# Altium project MB1165.PrjPCB (part 3 of 4)

## Sheet MCU.SchDoc: MCU
size A3; DocumentNumber: MB1165; Revision: C.1; SheetNumber: 2; SheetTotal: 17; Project: STM32469I-EVAL
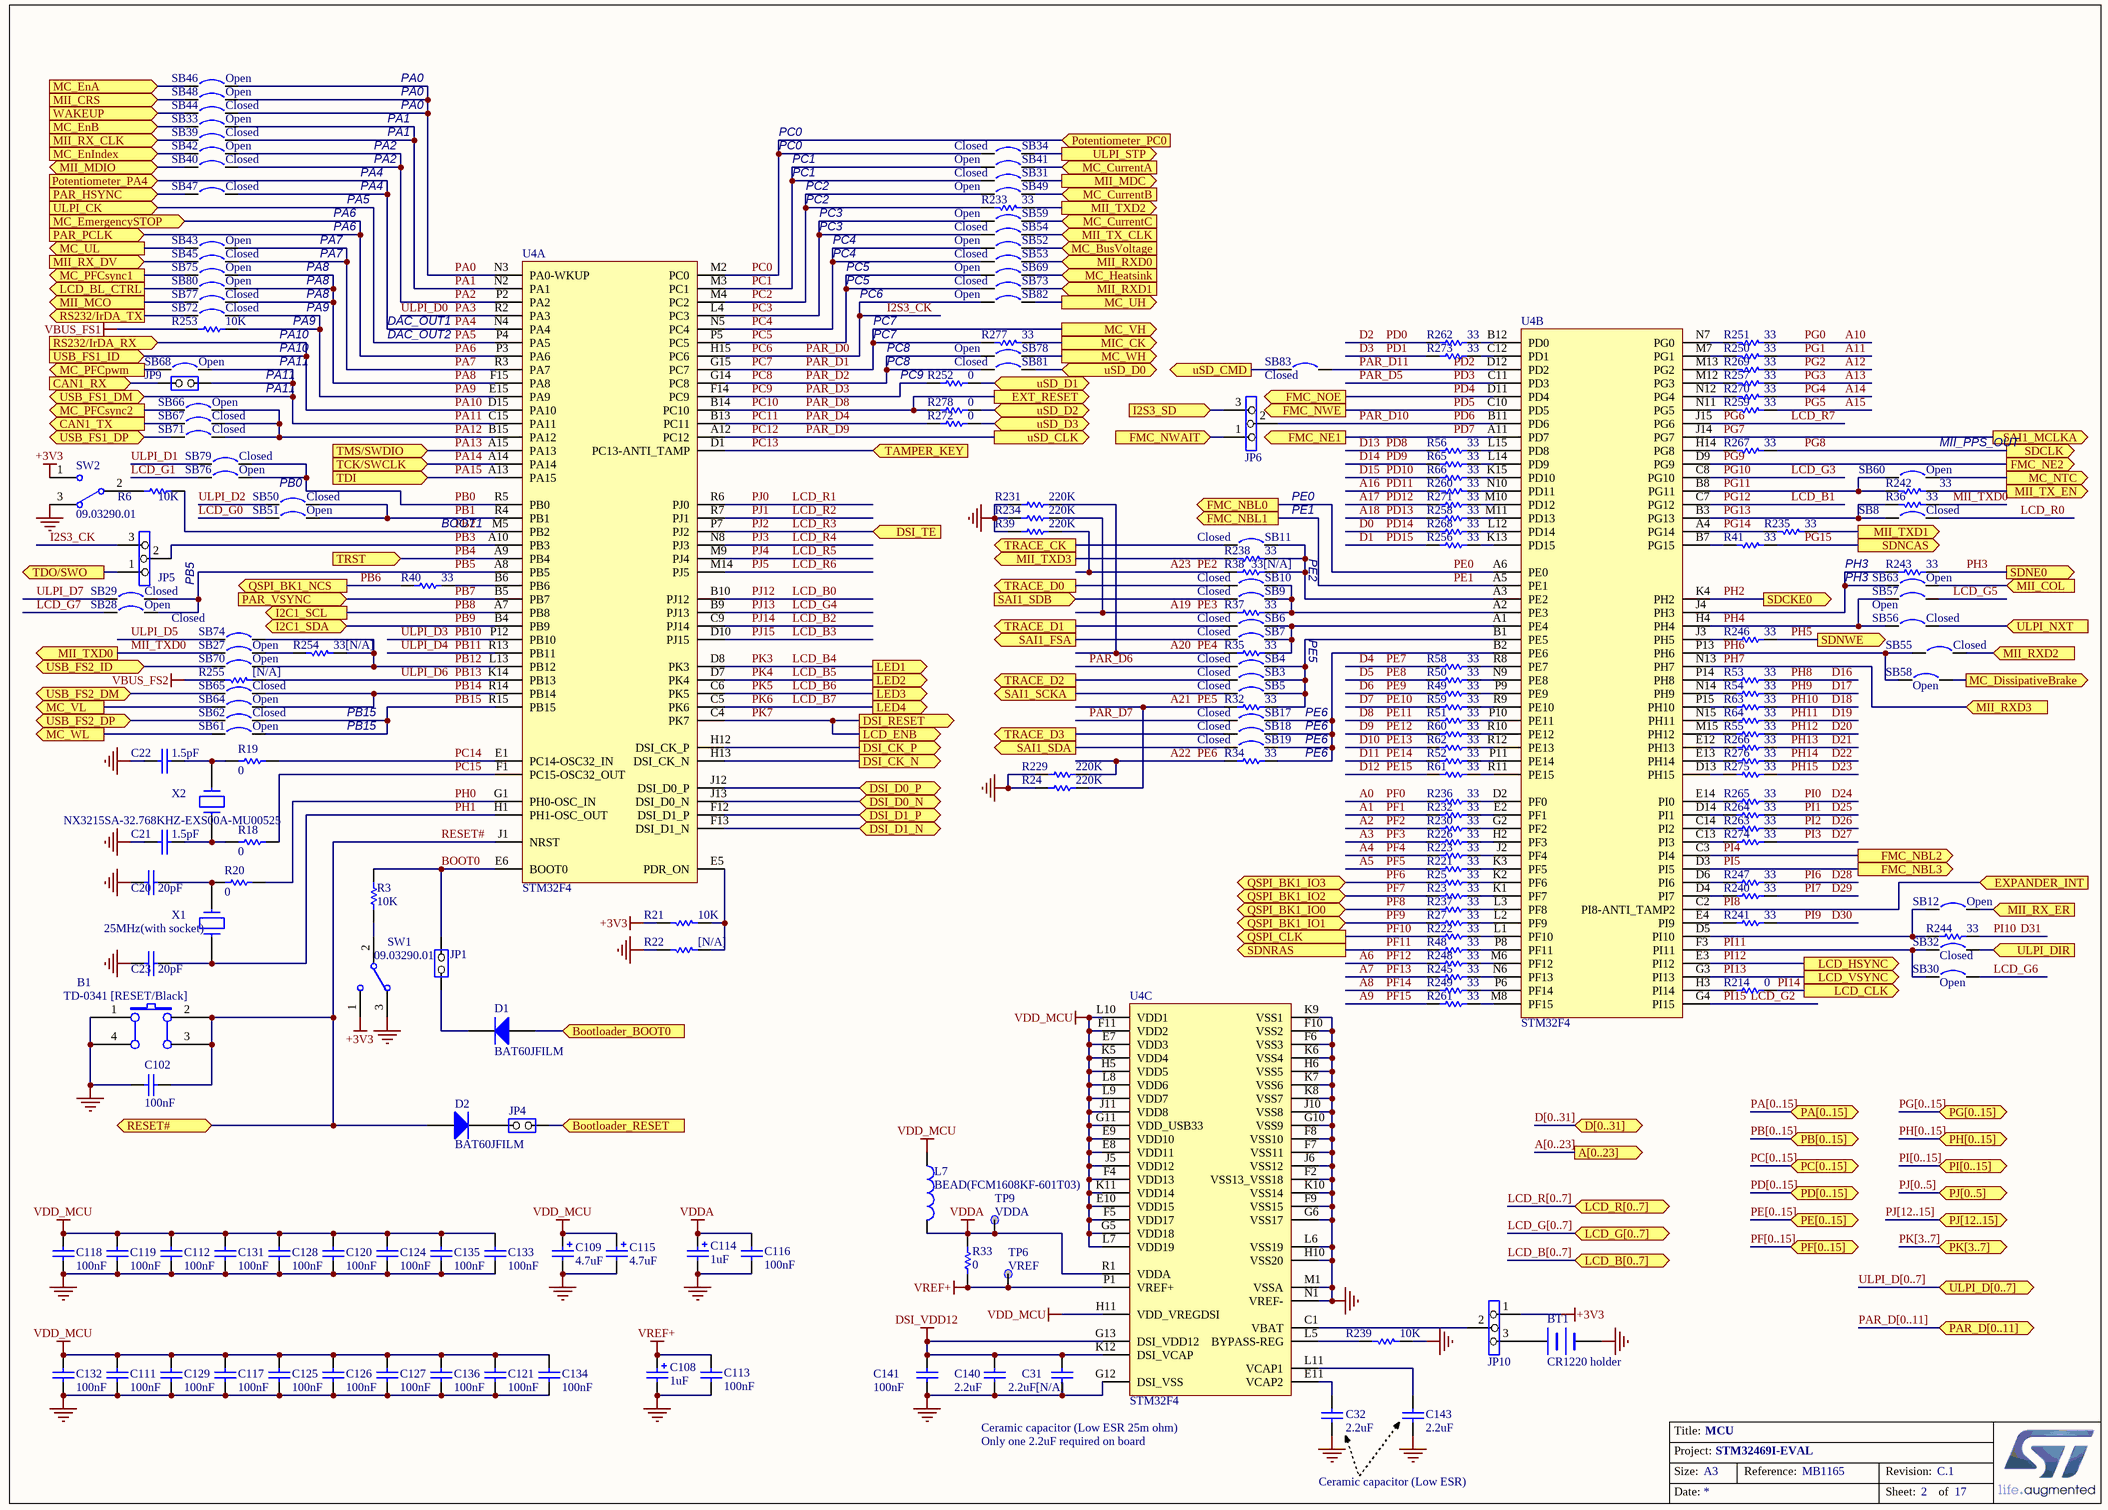
[diagram p14: MCU.SchDoc]

### Parts
B1  TD-0341 [RESET/Black]  [PB10]
BT1  CR1220 holder  [BAT_2SM_CR1220]
C20  20pF  [0603C]
C21  1.5pF  [0603C]
C22  1.5pF  [0603C]
C23  20pF  [0603C]
C31  2.2uF[N/A]  [1206C]
C32  2.2uF  [1206C]
C102  100nF  [0603C]
C108  1uF  [TAN-A]
C109  4.7uF  [TAN-A]
C111  100nF  [0402C]
C112  100nF  [0402C]
C113  100nF  [0402C]
C114  1uF  [TAN-A]
C115  4.7uF  [TAN-A]
C116  100nF  [0402C]
C117  100nF  [0402C]
C118  100nF  [0402C]
C119  100nF  [0402C]
C120  100nF  [0402C]
C121  100nF  [0402C]
C124  100nF  [0402C]
C125  100nF  [0402C]
C126  100nF  [0402C]
C127  100nF  [0402C]
C128  100nF  [0402C]
C129  100nF  [0402C]
C131  100nF  [0402C]
C132  100nF  [0402C]
C133  100nF  [0402C]
C134  100nF  [0402C]
C135  100nF  [0402C]
C136  100nF  [0402C]
C140  2.2uF  [0402C]
C141  100nF  [0402C]
C143  2.2uF  [1206C]
D1  BAT60JFILM  [SOD-323]
D2  BAT60JFILM  [SOD-323]
JP1  (no value)  [SIP2]
JP4  (no value)  [SIP2]
JP5  (no value)  [SIP3]
JP6  (no value)  [SIP3]
JP9  (no value)  [SIP2]
JP10  (no value)  [SIP3]
L7  BEAD(FCM1608KF-601T03)  [0603L]
R3  10K  [0603R]
R6  10K  [0603R]
R18  0  [0603R]
R19  0  [0603R]
R20  0  [0603R]
R21  10K  [0603R]
R22  [N/A]  [0603R]
R23  33  [0402R]
R24  220K  [0603R]
R25  33  [0402R]
R27  33  [0402R]
R32  33  [0402R]
R33  0  [0603R]
R34  33  [0402R]
R35  33  [0402R]
R36  33  [0603R]
R37  33  [0402R]
R38  33[N/A]  [0402R]
R39  220K  [0603R]
R40  33  [0402R]
R41  33  [0402R]
R48  33  [0402R]
R49  33  [0402R]
R50  33  [0402R]
R51  33  [0402R]
R52  33  [0402R]
R53  33  [0402R]
R54  33  [0402R]
R55  33  [0402R]
R56  33  [0402R]
R58  33  [0402R]
R59  33  [0402R]
R60  33  [0402R]
R61  33  [0402R]
R62  33  [0402R]
R63  33  [0402R]
R64  33  [0402R]
R65  33  [0402R]
R66  33  [0402R]
R214  0  [0603R]
R221  33  [0402R]
R222  33  [0402R]
R223  33  [0402R]
R226  33  [0402R]
R229  220K  [0603R]
R230  33  [0402R]
R231  220K  [0603R]
R232  33  [0402R]
R233  33  [0603R]
R234  220K  [0603R]
R235  33  [0603R]
R236  33  [0402R]
R237  33  [0402R]
R238  33  [0603R]
R239  10K  [0603R]
R240  33  [0402R]
R241  33  [0402R]
R242  33  [0603R]
R243  33  [0402R]
R244  33  [0402R]
R245  33  [0402R]
R246  33  [0402R]
R247  33  [0402R]
R248  33  [0402R]
R249  33  [0402R]
R250  33  [0402R]
R251  33  [0402R]
R252  0  [0603R]
R253  10K  [0603R]
R254  33[N/A]  [0603R]
R255  [N/A]  [0603R]
R256  33  [0402R]
R257  33  [0402R]
R258  33  [0402R]
R259  33  [0402R]
R260  33  [0402R]
R261  33  [0402R]
R262  33  [0402R]
R263  33  [0402R]
R264  33  [0402R]
R265  33  [0402R]
R266  33  [0402R]
R267  33  [0402R]
R268  33  [0402R]
R269  33  [0402R]
R270  33  [0402R]
R271  33  [0402R]
R272  0  [0603R]
R273  33  [0402R]
R274  33  [0402R]
R275  33  [0402R]
R276  33  [0402R]
R277  33  [0603R]
R278  0  [0603R]
SB3  Closed  [SB_0603]
SB4  Closed  [SB_0603]
SB5  Closed  [SB_0603]
SB6  Closed  [SB_0603]
SB7  Closed  [SB_0603]
SB8  Closed  [SB_0603]
SB9  Closed  [SB_0603]
SB10  Closed  [SB_0603]
SB11  Closed  [SB_0603]
SB12  Open  [SB_0603]
SB17  Closed  [SB_0603]
SB18  Closed  [SB_0603]
SB19  Closed  [SB_0603]
SB27  Open  [SB_0603]
SB28  Open  [SB_0603]
SB29  Closed  [SB_0603]
SB30  Open  [SB_0603]
SB31  Closed  [SB_0603]
SB32  Closed  [SB_0603]
SB33  Open  [SB_0603]
SB34  Closed  [SB_0603]
SB39  Closed  [SB_0603]
SB40  Closed  [SB_0603]
SB41  Open  [SB_0603]
SB42  Open  [SB_0603]
SB43  Open  [SB_0603]
SB44  Closed  [SB_0603]
SB45  Closed  [SB_0603]
SB46  Open  [SB_0603]
SB47  Closed  [SB_0603]
SB48  Open  [SB_0603]
SB49  Open  [SB_0603]
SB50  Closed  [SB_0603]
SB51  Open  [SB_0603]
SB52  Open  [SB_0603]
SB53  Closed  [SB_0603]
SB54  Closed  [SB_0603]
SB55  Closed  [SB_0603]
SB56  Closed  [SB_0603]
SB57  Open  [SB_0603]
SB58  Open  [SB_0603]
SB59  Open  [SB_0603]
SB60  Open  [SB_0603]
SB61  Open  [SB_0603]
SB62  Closed  [SB_0603]
SB63  Open  [SB_0603]
SB64  Open  [SB_0603]
SB65  Closed  [SB_0603]
SB66  Open  [SB_0603]
SB67  Closed  [SB_0603]
SB68  Open  [SB_0603]
SB69  Open  [SB_0603]
SB70  Open  [SB_0603]
SB71  Closed  [SB_0603]
SB72  Closed  [SB_0603]
SB73  Closed  [SB_0603]
SB74  Closed  [SB_0603]
SB75  Open  [SB_0603]
SB76  Open  [SB_0603]
SB77  Closed  [SB_0603]
SB78  Open  [SB_0603]
SB79  Closed  [SB_0603]
SB80  Open  [SB_0603]
SB81  Closed  [SB_0603]
SB82  Open  [SB_0603]
SB83  Closed  [SB_0603]
SW1  09.03290.01  [SW1_3TH_2R54_10X2R5]
SW2  09.03290.01  [SW1_3TH_2R54_10X2R5]
TP6  VREF  [TP]
TP9  VDDA  [TP]
U4  STM32F4  [BGA216_0R8_13X13_SKT]  (parts A,B,C of 3)
X1  25MHz(with socket)  [XTAL_socket]
X2  NX3215SA-32.768KHZ-EXS00A-MU00525  [XTAL_2SM_3R2X1R5]

### Ports
A[0..23] (out), Bootloader_BOOT0 (in), Bootloader_RESET (in), CAN1_RX (in), CAN1_TX (out), D[0..31] (bidir), DSI_CK_N (out), DSI_CK_P (out), DSI_D0_N (bidir), DSI_D0_P (bidir), DSI_D1_N (bidir), DSI_D1_P (bidir), DSI_RESET (out), DSI_TE (in), EXPANDER_INT (in), EXT_RESET (out), FMC_NBL0 (out), FMC_NBL1 (out), FMC_NBL2 (out), FMC_NBL3 (out), FMC_NE1 (out), FMC_NE2 (out), FMC_NOE (out), FMC_NWAIT (in), FMC_NWE (out), I2C1_SCL (out), I2C1_SDA (bidir), I2S3_SD (in), LCD_B[0..7] (bidir), LCD_BL_CTRL (out), LCD_CLK (out), LCD_ENB (out), LCD_G[0..7] (bidir), LCD_HSYNC (out), LCD_R[0..7] (bidir), LCD_VSYNC (out), LED1 (out), LED2 (out), LED3 (out), LED4 (out), MC_BusVoltage (in), MC_CurrentA (in), MC_CurrentB (in), MC_CurrentC (in), MC_DissipativeBrake (out), MC_EmergencySTOP (in), MC_EnA (in), MC_EnB (in), MC_EnIndex (in), MC_Heatsink (in), MC_NTC (out), MC_PFCpwm (out), MC_PFCsync1 (out), MC_PFCsync2 (out), MC_UH (out), MC_UL (out), MC_VH (out), MC_VL (out), MC_WH (out), MC_WL (out), MIC_CK (out), MII_COL (in), MII_CRS (in), MII_MCO (out), MII_MDC (out), MII_MDIO (bidir), MII_RX_CLK (in), MII_RX_DV (in), MII_RX_ER (in), MII_RXD0 (in), MII_RXD1 (in), MII_RXD2 (in), MII_RXD3 (in), MII_TX_CLK (in), MII_TX_EN (out), MII_TXD0 (out), MII_TXD1 (out), MII_TXD2 (out), MII_TXD3 (out), PA[0..15] (bidir), PAR_D[0..11] (bidir), PAR_HSYNC (in), PAR_PCLK (in), PAR_VSYNC (in), PB[0..15] (bidir), PC[0..15] (bidir), PD[0..15] (bidir), PE[0..15] (bidir), PF[0..15] (bidir), PG[0..15] (bidir), PH[0..15] (bidir), PI[0..15] (bidir), PJ[0..5] (bidir), PJ[12..15] (bidir), PK[3..7] (bidir), Potentiometer_PA4 (in), Potentiometer_PC0 (in), QSPI_BK1_IO0 (bidir), QSPI_BK1_IO1 (bidir), QSPI_BK1_IO2 (bidir), QSPI_BK1_IO3 (bidir), QSPI_BK1_NCS (out), QSPI_CLK (out), RESET# (bidir), RS232/IrDA_RX (in), RS232/IrDA_TX (out), SAI1_FSA (out), SAI1_MCLKA (out), SAI1_SCKA (out), SAI1_SDA (out), SAI1_SDB (in), SDCKE0 (out), SDCLK (out), SDNCAS (out), SDNE0 (out), SDNRAS (out), SDNWE (out), TAMPER_KEY (in), TCK/SWCLK (in), TDI (in), TDO/SWO (out), TMS/SWDIO (in), TRACE_CK (out), TRACE_D0 (out), TRACE_D1 (out), TRACE_D2 (out), TRACE_D3 (out), TRST (in), ULPI_CK (in), ULPI_D[0..7] (bidir), ULPI_DIR (in), ULPI_NXT (in), ULPI_STP (out), USB_FS1_DM (bidir), USB_FS1_DP (bidir), USB_FS1_ID (in), USB_FS2_DM (bidir), USB_FS2_DP (bidir), USB_FS2_ID (bidir), uSD_CLK (out), uSD_CMD (out), uSD_D0 (bidir), uSD_D1 (bidir), uSD_D2 (bidir), uSD_D3 (bidir), WAKEUP (in)

### Nets
+3V3: JP10.1 R21.2 SW1.1 SW2.1
DSI_VDD12: C31.1 C140.1 C141.1 U4.G13(DSI_VDD12) U4.K12(DSI_VCAP)
GND: B1.1(A0) B1.4(A1) BT1.2(-) C20.2 C21.2 C22.2 C23.2 C31.2 C32.2 C102.1 C108.2 C109.2 C111.2 C112.2 C113.1 C114.2 C115.2 C116.1 C117.2 C118.2 C119.2 C120.2 C121.2 C124.2 C125.2 C126.2 C127.2 C128.2 C129.2 C131.2 C132.2 C133.2 C134.2 C135.2 C136.2 C140.2 C141.2 C143.2 R22.2 R24.1 R39.1 R229.1 R231.1 R234.1 R239.1 SW1.3 SW2.3 U4.F2(VSS13_VSS18) U4.F6(VSS3) U4.F7(VSS11) U4.F8(VSS10) U4.F9(VSS15) U4.F10(VSS2) U4.G6(VSS17) U4.G10(VSS9) U4.G12(DSI_VSS) U4.H6(VSS5) U4.H10(VSS20) U4.J6(VSS12) U4.J10(VSS8) U4.K6(VSS4) U4.K7(VSS6) U4.K8(VSS7) U4.K9(VSS1) U4.K10(VSS14) U4.L6(VSS19) U4.M1(VSSA) U4.N1(VREF-)
VBUS_FS1: R253.2
VBUS_FS2: R255.1
VDD_MCU: C109.1 C111.1 C112.1 C115.1 C117.1 C118.1 C119.1 C120.1 C121.1 C124.1 C125.1 C126.1 C127.1 C128.1 C129.1 C131.1 C132.1 C133.1 C134.1 C135.1 C136.1 L7.1 U4.E7(VDD3) U4.E8(VDD11) U4.E9(VDD10) U4.E10(VDD15) U4.F4(VDD13) U4.F5(VDD17) U4.F11(VDD2) U4.G5(VDD18) U4.G11(VDD_USB33) U4.H5(VDD5) U4.H11(VDD_VREGDSI) U4.J5(VDD12) U4.J11(VDD8) U4.K5(VDD4) U4.K11(VDD14) U4.L7(VDD19) U4.L8(VDD6) U4.L9(VDD7) U4.L10(VDD1)
VDDA: C114.1 C116.2 L7.2 R33.1 TP9.1 U4.R1(VDDA)
VREF+: C108.1 C113.2 R33.2 TP6.1 U4.P1(VREF+)
A0: R236.2  [also labelled PF0]
A1: R232.2  [also labelled PF1]
A2: R230.2  [also labelled PF2]
A3: R226.2  [also labelled PF3]
A4: R223.2  [also labelled PF4]
A5: R221.2  [also labelled PF5]
A6: R248.2  [also labelled PF12]
A7: R245.2  [also labelled PF13]
A8: R249.2  [also labelled PF14]
A9: R261.2  [also labelled PF15]
A10: R251.2  [also labelled PG0]
A11: R250.2  [also labelled PG1]
A12: R269.2  [also labelled PG2]
A13: R257.2  [also labelled PG3]
A14: R270.2  [also labelled PG4]
A15: R259.2  [also labelled PG5]
A16: R260.1  [also labelled PD11]
A17: R271.2  [also labelled PD12]
A18: R258.2  [also labelled PD13]
A19: R37.2 R234.2  [also labelled PE3]
A20: R35.2 R231.2  [also labelled PE4]
A21: R24.2 R32.2  [also labelled PE5]
A22: R34.2 R229.2  [also labelled PE6]
A23: R38.2 R39.2  [also labelled PE2]
BOOT0: JP1.2(NO) R3.1 U4.E6(BOOT0)
D0: R268.2  [also labelled PD14]
D1: R256.2  [also labelled PD15]
D2: R262.2  [also labelled PD0]
D3: R273.2  [also labelled PD1]
D4: R58.2  [also labelled PE7]
D5: R50.2  [also labelled PE8]
D6: R49.2  [also labelled PE9]
D7: R59.2  [also labelled PE10]
D8: R51.2  [also labelled PE11]
D9: R60.2  [also labelled PE12]
D10: R62.2  [also labelled PE13]
D11: R52.2  [also labelled PE14]
D12: R61.2  [also labelled PE15]
D13: R56.2  [also labelled PD8]
D14: R65.2  [also labelled PD9]
D15: R66.2  [also labelled PD10]
D16: R53.1  [also labelled PH8]
D17: R54.1  [also labelled PH9]
D18: R63.1  [also labelled PH10]
D19: R64.1  [also labelled PH11]
D20: R55.1  [also labelled PH12]
D21: R266.1  [also labelled PH13]
D22: R276.1  [also labelled PH14]
D23: R275.1  [also labelled PH15]
D24: R265.1  [also labelled PI0]
D25: R264.1  [also labelled PI1]
D26: R263.1  [also labelled PI2]
D27: R274.1  [also labelled PI3]
D28: R247.1  [also labelled PI6]
D29: R240.1  [also labelled PI7]
D30: R241.1  [also labelled PI9]
D31: R244.1  [also labelled PI10]
I2S3_CK: JP5.3 SB82.1 U4.H15(PC6)  [also labelled PAR_D0, PC6]
LCD_B0: U4.B10(PJ12)  [also labelled PJ12]
LCD_B1: U4.C7(PG12)  [also labelled PG12]
LCD_B2: U4.C9(PJ14)  [also labelled PJ14]
LCD_B3: U4.D10(PJ15)  [also labelled PJ15]
LCD_B4: U4.D8(PK3) ; port LED1  [also labelled PK3]
LCD_B5: U4.D7(PK4) ; port LED2  [also labelled PK4]
LCD_B6: U4.C6(PK5) ; port LED3  [also labelled PK5]
LCD_B7: U4.C5(PK6) ; port LED4  [also labelled PK6]
LCD_BL_CTRL: SB80.1 ; port LCD_BL_CTRL
LCD_G0: SB51.1
LCD_G1: SB76.1
LCD_G2: U4.G4(PI15)  [also labelled PI15]
LCD_G3: U4.C8(PG10)  [also labelled PG10]
LCD_G4: U4.B9(PJ13)  [also labelled PJ13]
LCD_G5: SB57.2
LCD_G6: SB30.2
LCD_G7: SB28.1
LCD_R0: SB8.2
LCD_R1: U4.R6(PJ0)  [also labelled PJ0]
LCD_R2: U4.R7(PJ1)  [also labelled PJ1]
LCD_R3: U4.P7(PJ2) ; port DSI_TE  [also labelled PJ2]
LCD_R4: U4.N8(PJ3)  [also labelled PJ3]
LCD_R5: U4.M9(PJ4)  [also labelled PJ4]
LCD_R6: U4.M14(PJ5)  [also labelled PJ5]
LCD_R7: U4.J15(PG6)  [also labelled PG6]
MII_TXD0: R36.2 SB27.1 ; port MII_TXD0
PA0: SB44.2 SB46.2 SB48.2 U4.N3(PA0-WKUP)
PA1: SB33.2 SB39.2 U4.N2(PA1)
PA2: SB40.2 SB42.2 U4.P2(PA2)
PA3: U4.R2(PA3)  [also labelled ULPI_D0]
PA4: SB47.2 U4.N4(PA4) ; port Potentiometer_PA4
PA5: U4.P4(PA5) ; port ULPI_CK
PA6: U4.P3(PA6) ; port MC_EmergencySTOP, port PAR_PCLK
PA7: SB43.2 SB45.2 U4.R3(PA7)
PA8: SB75.2 SB77.2 SB80.2 U4.F15(PA8)
PA9: R253.1 SB72.2 U4.E15(PA9)
PA10: U4.D15(PA10) ; port RS232/IrDA_RX, port USB_FS1_ID
PA11: JP9.1(COMMON) SB68.2 U4.C15(PA11) ; port USB_FS1_DM
PA12: SB66.2 SB67.2 SB71.2 U4.B15(PA12)
PA13: U4.A15(PA13) ; port TMS/SWDIO
PA14: U4.A14(PA14) ; port TCK/SWCLK
PA15: U4.A13(PA15) ; port TDI
PAR_D1: R277.1 U4.G15(PC7) ; port MC_VH  [also labelled PC7]
PAR_D2: SB78.1 SB81.1 U4.G14(PC8)  [also labelled PC8]
PAR_D3: R252.2 U4.F14(PC9)  [also labelled PC9]
PAR_D4: R272.2 U4.B13(PC11)  [also labelled PC11]
PAR_D5: U4.C11(PD3)  [also labelled PD3]
PAR_D6: SB4.1
PAR_D7: SB17.1
PAR_D8: R278.2 U4.B14(PC10) ; port EXT_RESET  [also labelled PC10]
PAR_D9: U4.A12(PC12) ; port uSD_CLK  [also labelled PC12]
PAR_D10: JP6.2 U4.B11(PD6)  [also labelled PD6]
PAR_D11: SB83.2 U4.D12(PD2)  [also labelled PD2]
PB0: SB76.2 SB79.2 U4.R5(PB0)
PB1: SB50.2 SB51.2 U4.R4(PB1)
PB2: R6.2 U4.M5(PB2)
PB3: JP5.2 U4.A10(PB3)
PB4: U4.A9(PB4) ; port TRST
PB5: SB28.2 SB29.2 U4.A8(PB5)
PB6: R40.2 ; port QSPI_BK1_NCS
PB7: U4.B5(PB7) ; port PAR_VSYNC
PB8: U4.A7(PB8) ; port I2C1_SCL  [project net I2C1_SCL]
PB9: U4.B4(PB9) ; port I2C1_SDA  [project net I2C1_SDA]
PB10: U4.P12(PB10)  [also labelled ULPI_D3]
PB11: U4.R13(PB11)  [also labelled ULPI_D4]
PB12: R254.2 SB70.2 SB74.2 U4.L13(PB12)
PB13: R255.2 U4.K14(PB13)  [also labelled ULPI_D6]
PB14: SB64.2 SB65.2 U4.R14(PB14)
PB15: SB61.2 SB62.2 U4.R15(PB15)
PC0: SB34.1 U4.M2(PC0) ; port Potentiometer_PC0
PC1: SB31.1 SB41.1 U4.M3(PC1)
PC2: R233.1 SB49.1 U4.M4(PC2)
PC3: SB54.1 SB59.1 U4.L4(PC3)
PC4: SB52.1 SB53.1 U4.N5(PC4)
PC5: SB69.1 SB73.1 U4.P5(PC5)
PC13: U4.D1(PC13-ANTI_TAMP) ; port TAMPER_KEY
PC14: R19.2 U4.E1(PC14-OSC32_IN)
PC15: R18.2 U4.F1(PC15-OSC32_OUT)
PD4: U4.D11(PD4) ; port FMC_NOE
PD5: U4.C10(PD5) ; port FMC_NWE
PD7: U4.A11(PD7) ; port FMC_NE1
PE0: U4.A6(PE0) ; port FMC_NBL0
PE1: U4.A5(PE1) ; port FMC_NBL1
PF6: R25.2 ; port QSPI_BK1_IO3
PF7: R23.2 ; port QSPI_BK1_IO2
PF8: R237.2 ; port QSPI_BK1_IO0
PF9: R27.2 ; port QSPI_BK1_IO1
PF10: R222.2 ; port QSPI_CLK
PF11: R48.2 ; port SDNRAS
PG7: U4.J14(PG7) ; port SAI1_MCLKA
PG8: R267.2 ; port SDCLK
PG9: U4.D9(PG9) ; port FMC_NE2
PG11: R242.1 SB60.1 U4.B8(PG11)
PG13: R36.1 SB8.1 U4.B3(PG13)
PG14: R235.1 U4.A4(PG14)
PG15: R41.2 ; port SDNCAS
PH0: R20.1 U4.G1(PH0-OSC_IN)
PH1: C23.1 U4.H1(PH1-OSC_OUT) X1.1
PH2: U4.K4(PH2) ; port SDCKE0
PH3: R243.1 ; port SDNE0
PH4: SB56.1 SB57.1 U4.H4(PH4)
PH5: R246.1 ; port SDNWE
PH6: SB55.1 SB58.1 U4.P13(PH6)
PH7: U4.N13(PH7) ; port MII_RXD3
PI4: U4.C3(PI4) ; port FMC_NBL2
PI5: U4.D3(PI5) ; port FMC_NBL3
PI8: U4.C2(PI8-ANTI_TAMP2) ; port EXPANDER_INT
PI11: SB30.1 SB32.1 U4.F3(PI11)
PI12: U4.E3(PI12) ; port LCD_HSYNC
PI13: U4.G3(PI13) ; port LCD_VSYNC
PI14: R214.1 ; port LCD_CLK
PK7: U4.C4(PK7) ; port LCD_ENB, port DSI_RESET
RESET#: B1.2(B0) B1.3(B1) C102.2 D2.1(A) U4.J1(NRST) ; port RESET#
T_JTDO: JP5.1 ; port TDO/SWO
ULPI_D1: SB79.1
ULPI_D2: SB50.1
ULPI_D5: SB74.1
ULPI_D7: SB29.1
NetBT1_1: BT1.1(+) JP10.3
NetC6_2: SB46.1 ; port MC_EnA
NetC7_2: SB66.1 ; port MC_PFCsync2
NetC8_2: SB33.1 ; port MC_EnB
NetC9_2: SB42.1 ; port MC_EnIndex
NetC10_2: SB68.1 ; port MC_PFCpwm
NetC11_1: SB69.2 ; port MC_Heatsink
NetC12_2: SB59.2 ; port MC_CurrentC
NetC13_2: SB49.2 ; port MC_CurrentB
NetC14_2: SB41.2 ; port MC_CurrentA
NetC15_1: SB52.2 ; port MC_BusVoltage
NetC18_2: SB75.1 ; port MC_PFCsync1
NetC20_1: C20.1 R20.2 X1.2
NetC21_1: C21.1 R18.1 X2.1
NetC22_1: C22.1 R19.1 X2.2
NetC32_1: C32.1 U4.E11(VCAP2)
NetC143_1: C143.1 U4.L11(VCAP1)
NetCN1_3: SB82.2 ; port MC_UH
NetCN1_5: SB43.1 ; port MC_UL
NetCN1_9: SB64.1 ; port MC_VL
NetCN1_11: SB78.2 ; port MC_WH
NetCN1_13: SB61.1 ; port MC_WL
NetCN1_21: SB60.2 ; port MC_NTC
NetCN1_23: SB58.2 ; port MC_DissipativeBrake
NetCN4_31: SB47.1 ; port PAR_HSYNC
NetCN11_6: JP6.1 ; port FMC_NWAIT
NetCN12_12: SB11.1 ; port TRACE_CK
NetCN12_14: SB10.1 ; port TRACE_D0
NetCN12_16: SB6.1 ; port TRACE_D1
NetCN12_18: SB3.1 ; port TRACE_D2
NetCN12_20: SB18.1 ; port TRACE_D3
NetCN14_4: SB70.1 ; port USB_FS2_ID
NetCN15_3: U4.H12(DSI_CK_P) ; port DSI_CK_P
NetCN15_5: U4.H13(DSI_CK_N) ; port DSI_CK_N
NetCN15_9: U4.J12(DSI_D0_P) ; port DSI_D0_P
NetCN15_11: U4.J13(DSI_D0_N) ; port DSI_D0_N
NetCN15_15: U4.F12(DSI_D1_P) ; port DSI_D1_P
NetCN15_17: U4.F13(DSI_D1_N) ; port DSI_D1_N
NetCN17_1: R278.1 ; port uSD_D2
NetCN17_2: R272.1 ; port uSD_D3
NetCN17_3: SB83.1 ; port uSD_CMD
NetCN17_7: SB81.2 ; port uSD_D0
NetCN17_8: R252.1 ; port uSD_D1
NetD1_1: D1.1(A) ; port Bootloader_BOOT0
NetD1_2: D1.2(K) JP1.1(COMMON)
NetD2_2: D2.2(K) JP4.1(COMMON)
NetD5_C3: SB71.1 ; port USB_FS1_DP
NetD6_C3: SB62.1 ; port USB_FS2_DP
NetD6_D3: SB65.1 ; port USB_FS2_DM
NetJP4_2: JP4.2(NO) ; port Bootloader_RESET
NetJP6_3: JP6.3 ; port I2S3_SD
NetJP7_3: SB77.1 ; port MII_MCO
NetJP9_2: JP9.2(NO) ; port CAN1_RX
NetJP10_2: JP10.2 U4.C1(VBAT)
NetJP18_3: R277.2 ; port MIC_CK
NetJP19_2: SB72.1 ; port RS232/IrDA_TX
NetR3_2: R3.2 SW1.2
NetR6_1: R6.1 SW2.2
NetR21_1: R21.1 R22.1 U4.E5(PDR_ON)
NetR23_1: R23.1 U4.K1(PF7)
NetR25_1: R25.1 U4.K2(PF6)
NetR27_1: R27.1 U4.L2(PF9)
NetR32_1: R32.1 SB3.2 SB4.2 SB5.2 U4.B1(PE5)
NetR34_1: R34.1 SB17.2 SB18.2 SB19.2 U4.B2(PE6)
NetR35_1: R35.1 SB6.2 SB7.2 U4.A1(PE4)
NetR37_1: R37.1 SB9.2 SB10.2 U4.A2(PE3)
NetR38_1: R38.1 R238.2 SB11.2 U4.A3(PE2)
NetR40_1: R40.1 U4.B6(PB6)
NetR41_1: R41.1 U4.B7(PG15)
NetR43_2: SB55.2 ; port MII_RXD2
NetR44_2: SB73.2 ; port MII_RXD1
NetR45_2: SB53.2 ; port MII_RXD0
NetR46_2: SB45.1 ; port MII_RX_DV
NetR47_2: SB39.1 ; port MII_RX_CLK
NetR48_1: R48.1 U4.P8(PF11)
NetR49_1: R49.1 U4.P9(PE9)
NetR50_1: R50.1 U4.N9(PE8)
NetR51_1: R51.1 U4.P10(PE11)
NetR52_1: R52.1 U4.P11(PE14)
NetR53_2: R53.2 U4.P14(PH8)
NetR54_2: R54.2 U4.N14(PH9)
NetR55_2: R55.2 U4.M15(PH12)
NetR56_1: R56.1 U4.L15(PD8)
NetR57_2: SB54.2 ; port MII_TX_CLK
NetR58_1: R58.1 U4.R8(PE7)
NetR59_1: R59.1 U4.R9(PE10)
NetR60_1: R60.1 U4.R10(PE12)
NetR61_1: R61.1 U4.R11(PE15)
NetR62_1: R62.1 U4.R12(PE13)
NetR63_2: R63.2 U4.P15(PH10)
NetR64_2: R64.2 U4.N15(PH11)
NetR65_1: R65.1 U4.L14(PD9)
NetR66_1: R66.1 U4.K15(PD10)
NetR69_1: SB40.1 ; port MII_MDIO
NetR163_2: SB44.1 ; port WAKEUP
NetR214_2: R214.2 U4.H3(PI14)
NetR221_1: R221.1 U4.K3(PF5)
NetR222_1: R222.1 U4.L1(PF10)
NetR223_1: R223.1 U4.J2(PF4)
NetR226_1: R226.1 U4.H2(PF3)
NetR230_1: R230.1 U4.G2(PF2)
NetR232_1: R232.1 U4.E2(PF1)
NetR233_2: R233.2 ; port MII_TXD2
NetR235_2: R235.2 ; port MII_TXD1
NetR236_1: R236.1 U4.D2(PF0)
NetR237_1: R237.1 U4.L3(PF8)
NetR238_1: R238.1 ; port MII_TXD3
NetR239_2: R239.2 U4.L5(BYPASS-REG)
NetR240_2: R240.2 U4.D4(PI7)
NetR241_2: R241.2 U4.E4(PI9)
NetR242_2: R242.2 ; port MII_TX_EN
NetR243_2: R243.2 SB63.1 U4.J4(PH3)
NetR244_2: R244.2 SB12.1 U4.D5(PI10)
NetR245_1: R245.1 U4.N6(PF13)
NetR246_2: R246.2 U4.J3(PH5)
NetR247_2: R247.2 U4.D6(PI6)
NetR248_1: R248.1 U4.M6(PF12)
NetR249_1: R249.1 U4.P6(PF14)
NetR250_1: R250.1 U4.M7(PG1)
NetR251_1: R251.1 U4.N7(PG0)
NetR254_1: R254.1 SB27.2
NetR256_1: R256.1 U4.K13(PD15)
NetR257_1: R257.1 U4.M12(PG3)
NetR258_1: R258.1 U4.M11(PD13)
NetR259_1: R259.1 U4.N11(PG5)
NetR260_2: R260.2 U4.N10(PD11)
NetR261_1: R261.1 U4.M8(PF15)
NetR262_1: R262.1 U4.B12(PD0)
NetR263_2: R263.2 U4.C14(PI2)
NetR264_2: R264.2 U4.D14(PI1)
NetR265_2: R265.2 U4.E14(PI0)
NetR266_2: R266.2 U4.E12(PH13)
NetR267_1: R267.1 U4.H14(PG8)
NetR268_1: R268.1 U4.L12(PD14)
NetR269_1: R269.1 U4.M13(PG2)
NetR270_1: R270.1 U4.N12(PG4)
NetR271_1: R271.1 U4.M10(PD12)
NetR273_1: R273.1 U4.C12(PD1)
NetR274_2: R274.2 U4.C13(PI3)
NetR275_2: R275.2 U4.D13(PH15)
NetR276_2: R276.2 U4.E13(PH14)
NetSB5_1: SB5.1 ; port SAI1_SCKA
NetSB7_1: SB7.1 ; port SAI1_FSA
NetSB9_1: SB9.1 ; port SAI1_SDB
NetSB12_2: SB12.2 ; port MII_RX_ER
NetSB19_1: SB19.1 ; port SAI1_SDA
NetSB31_2: SB31.2 ; port MII_MDC
NetSB32_2: SB32.2 ; port ULPI_DIR
NetSB34_2: SB34.2 ; port ULPI_STP
NetSB48_1: SB48.1 ; port MII_CRS
NetSB56_2: SB56.2 ; port ULPI_NXT
NetSB63_2: SB63.2 ; port MII_COL
NetSB67_1: SB67.1 ; port CAN1_TX

### Buses and harness runs
bus A[0..23] = port A[0..23]
bus D[0..31] = port D[0..31]
bus LCD_B[0..7] = port LCD_B[0..7]
bus LCD_G[0..7] = port LCD_G[0..7]
bus LCD_R[0..7] = port LCD_R[0..7]
bus PA[0..15] = port PA[0..15]
bus PAR_D[0..11] = port PAR_D[0..11]
bus PB[0..15] = port PB[0..15]
bus PC[0..15] = port PC[0..15]
bus PD[0..15] = port PD[0..15]
bus PE[0..15] = port PE[0..15]
bus PF[0..15] = port PF[0..15]
bus PG[0..15] = port PG[0..15]
bus PH[0..15] = port PH[0..15]
bus PI[0..15] = port PI[0..15]
bus PJ[0..5] = port PJ[0..5]
bus PJ[12..15] = port PJ[12..15]
bus PK[3..7] = port PK[3..7]
bus ULPI_D[0..7] = port ULPI_D[0..7]

### Notes on the sheet
- PA0
- PA4
- PA2
- PA1
- PC0
- PC1
- PA7
- PA6
- PA5
- PC2
- PC3
- PC4
- PA8
- PA9
- PC5
- PC6
- PA11
- PA10
- DAC_OUT1
- DAC_OUT2
- PC7
- PC8
- PC9
- MII_PPS_OUT
- (near SB50) PB0
- PE0
- PE1
- PB5
- BOOT1
- PE2
- PH3
- PE5
- PB15
- PE6
- Ceramic capacitor (Low ESR 25m ohm)
- Only one 2.2uF required on board
- Ceramic capacitor (Low ESR)
- Title:
- Project:
- Size:
- Date:
- A3
- Reference:
- Sheet:
- Revision:
- of

### Library data of the parts
B1 = SW PUSHBUTTON: SE PUSHBUTTON
BT1 = BATTERY
C20-C23 C111 C112 C117-C121 C124-C129 C131-C136 C141 = CAP: Capacitor
  C111 C112 C117-C121 C124-C129 C131-C136 C141: Published: 8-Jun-2000; Revision: July-2002: Re-released for DXP Platform.; Publisher: Altium Limited; Value: 100nF
C31 C32 C113 C116 C143 = Cap: Capacitor; Value: 10nF; Published: 8-Jun-2000; Revision: July-2002: Re-released for DXP Platform.; Publisher: Altium Limited
C102 = CAP: Capacitor; Value: 100pF; Published: 8-Jun-2000; Revision: July-2002: Re-released for DXP Platform.; Publisher: Altium Limited
C108 C114 = Cap Pol1: Polarized Capacitor (Radial); Value: 10uF; Published: 8-Jun-2000; Revision: July-2002: Re-released for DXP Platform.; Publisher: Altium Limited
C109 C115 = Cap Pol1: Polarized Capacitor (Radial); Value: 47uF; Published: 8-Jun-2000; Revision: July-2002: Re-released for DXP Platform.; Publisher: Altium Limited
C140 = CAP: Capacitor; Value: 100nF; Published: 8-Jun-2000; Revision: July-2002: Re-released for DXP Platform.; Publisher: Altium Limited
D1 D2 = Diode: Default Diode; Code - JEDEC: DO-214-AB; Published: 8-Jun-2000; Revision: July-2002: Re-released for DXP Platform.; Publisher: Altium Limited
JP1 JP4 JP9 = JP2
JP5 JP6 JP10 = Jumper3
L7 = Inductor: Value: 100uH; Published: 8-Jun-2000; Revision: July-2002: Re-released for DXP Platform.; Publisher: Altium Limited
R3 R24 R39 R229 R231 R234 R253 = res1: Resistor; Value: 1K; Published: 8-Jun-2000; Revision: July-2002: Re-released for DXP Platform.; Publisher: Altium Limited
R6 R18-R23 R25 R27 R32-R38 R40 R41 R48-R56 R58-R66 R214 R221-R223 R226 R230 R232 R233 R235-R252 R254-R278 = Res1: Resistor; Value: 1K; Published: 8-Jun-2000; Revision: July-2002: Re-released for DXP Platform.; Publisher: Altium Limited
SB3-SB11 SB17-SB19 SB29 SB31 SB32 SB34 SB39 SB40 SB44 SB45 SB47 SB50 SB53-SB56 SB62 SB65 SB67 SB71-SB74 SB77 SB79 SB81 SB83 = Circuit Breaker_close: Circuit Breaker; Published: 24-Mar-1999; Revision: July-2002: Re-released for DXP Platform.; Publisher: Altium Limited
SB12 SB27 SB28 SB30 SB33 SB41-SB43 SB46 SB48 SB49 SB51 SB52 SB57-SB61 SB63 SB64 SB66 SB68-SB70 SB75 SB76 SB78 SB80 SB82 = Circuit Breaker: Published: 24-Mar-1999; Revision: July-2002: Re-released for DXP Platform.; Publisher: Altium Limited
SW1 SW2 = SW-SPDT: SPDT Subminiature Toggle Switch, Right Angle Mounting, Vertical Actuation; Revision 1: Jul-2002: Re-released for DXP Platform.; Revision 2: 17-Dec-2003: Schematic revised, PCB Footprint replaced.; Published: 24-Mar-1999; Datasheet: Latest Revision: 05-Dec-2000; Publisher: Altium Limited
TP6 TP9 = TP
U4 = Manta_Dragon_TFBGA216
X1 = CRYSTAL
X2 = CRYSTAL_32K: Crystal

## Sheet LCD&Camera&Connectors.SchDoc: LCD & Camera & Connector
size A4; DocumentNumber: MB1165; Revision: C.1; SheetNumber: 6; SheetTotal: 17; Project: STM32469I-EVAL
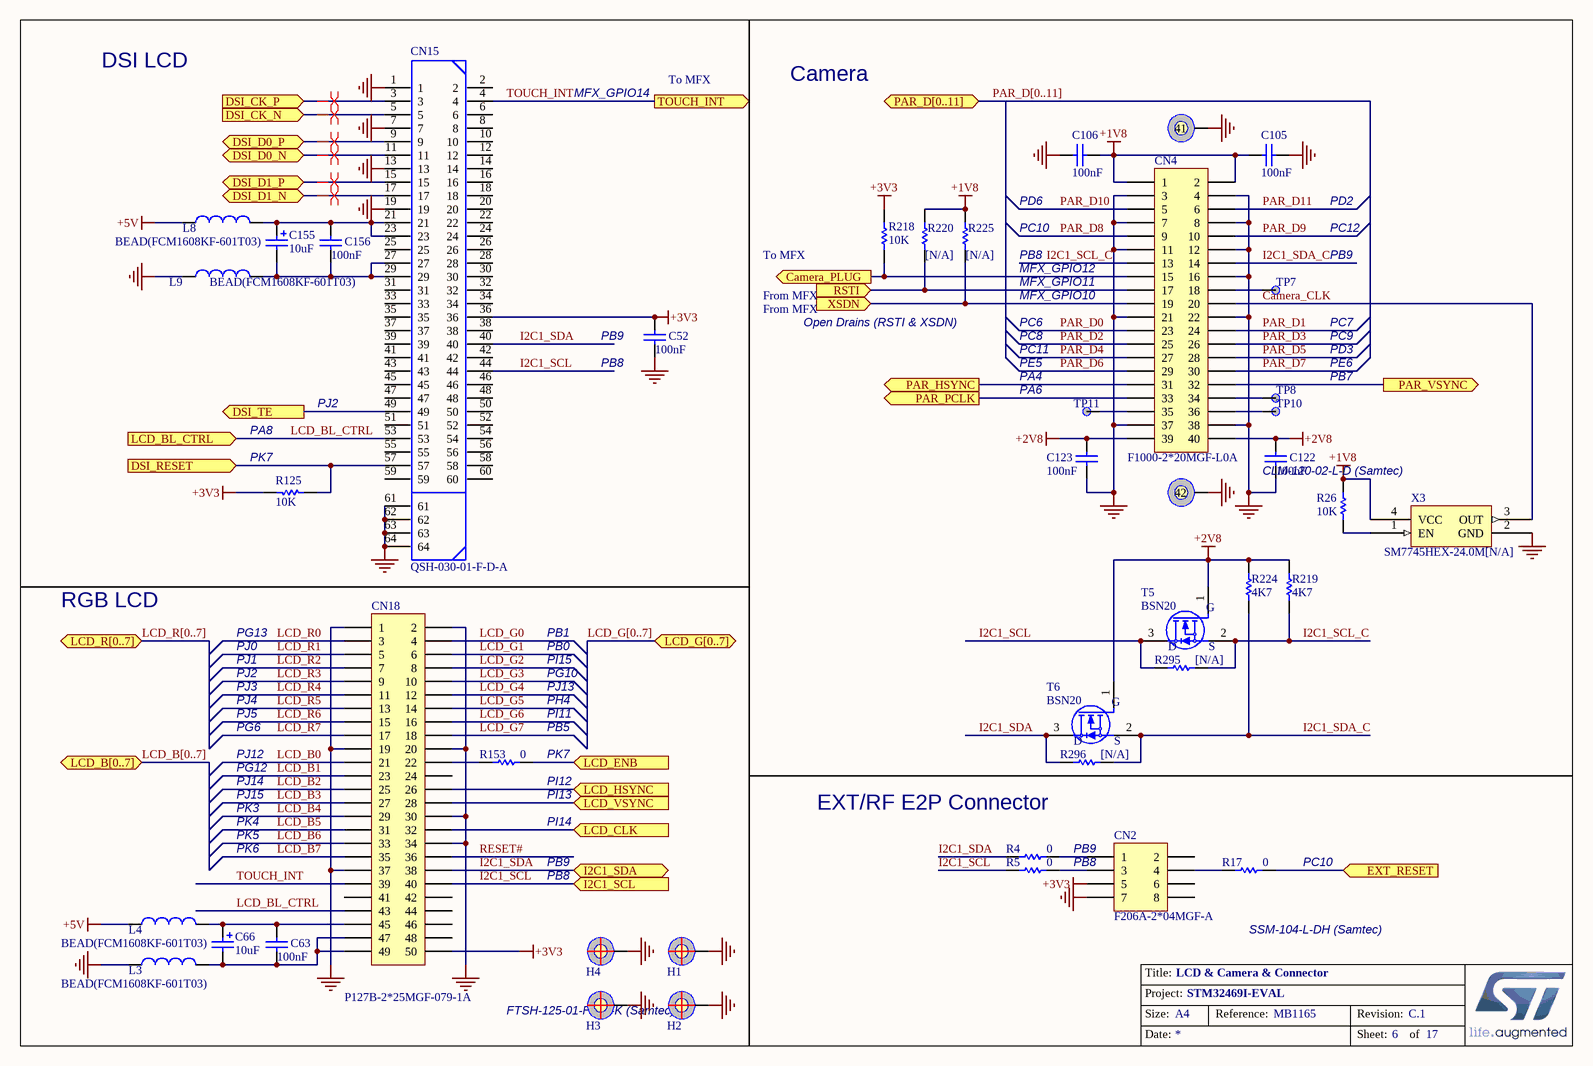
[diagram p15: LCD&Camera&Connectors.SchDoc]

### Parts
C52  100nF  [0603C]
C63  100nF  [0603C]
C66  10uF  [TAN-A]
C105  100nF  [0603C]
C106  100nF  [0603C]
C122  100nF  [0603C]
C123  100nF  [0603C]
C155  10uF  [TAN-A]
C156  100nF  [0603C]
CN2  F206A-2*04MGF-A  [SSM-104-L-DH]
CN4  F1000-2*20MGF-L0A  [CLM-120-02-L-D]
CN15  QSH-030-01-F-D-A  [QSH-030-01-F-D-A]
CN18  P127B-2*25MGF-079-1A  [FTSH-125-01-F-DV]
H1  POSITION HOLE  [HOLE_C9D4R5]  (value not drawn)
H2  POSITION HOLE  [HOLE_C9D4R5]  (value not drawn)
H3  POSITION HOLE  [HOLE_C9D4R5]  (value not drawn)
H4  POSITION HOLE  [HOLE_C9D4R5]  (value not drawn)
L3  BEAD(FCM1608KF-601T03)  [0603L]
L4  BEAD(FCM1608KF-601T03)  [0603L]
L8  BEAD(FCM1608KF-601T03)  [0603L]
L9  BEAD(FCM1608KF-601T03)  [0603L]
R4  0  [0603R]
R5  0  [0603R]
R17  0  [0603R]
R26  10K  [0402R]
R125  10K  [0603R]
R153  0  [0603R]
R218  10K  [0603R]
R219  4K7  [0603R]
R220  [N/A]  [0603R]
R224  4K7  [0603R]
R225  [N/A]  [0603R]
R295  [N/A]  [0603R]
R296  [N/A]  [0603R]
T5  BSN20  [SOT-23]
T6  BSN20  [SOT-23]
TP7  (no value)  [TP]
TP8  (no value)  [TP]
TP10  (no value)  [TP]
TP11  (no value)  [TP]
X3  SM7745HEX-24.0M[N/A]  [OSC_4SM_7X5]

### Ports
Camera_PLUG (out), DSI_CK_N (in), DSI_CK_P (in), DSI_D0_N (bidir), DSI_D0_P (bidir), DSI_D1_N (bidir), DSI_D1_P (bidir), DSI_RESET (in), DSI_TE (out), EXT_RESET (in), I2C1_SCL (in), I2C1_SDA (bidir), LCD_B[0..7] (bidir), LCD_BL_CTRL (in), LCD_CLK (in), LCD_ENB (in), LCD_G[0..7] (bidir), LCD_HSYNC (in), LCD_R[0..7] (bidir), LCD_VSYNC (in), PAR_D[0..11] (bidir), PAR_HSYNC (out), PAR_PCLK (out), PAR_VSYNC (out), RSTI (in), TOUCH_INT (out), XSDN (in)

### Nets
+1V8: C105.1 C106.2 CN4.1 CN4.2 R26.2 R220.2 R225.2 X3.4(VCC)
+2V8: C122.1 C123.1 CN4.39 CN4.40 R219.2 R224.2 T5.1(G) T6.1(G)
+3V3: C52.1 CN2.5 CN15.36 CN18.50 R125.2 R218.1
+5V: L4.1 L8.1
GND: C52.2 C105.2 C106.1 C122.2 C123.2 CN2.7 CN4.3 CN4.4 CN4.7 CN4.8 CN4.11 CN4.12 CN4.16 CN4.21 CN4.22 CN4.37 CN4.38 CN4.41 CN4.42 CN15.1 CN15.7 CN15.13 CN15.19 CN15.61 CN15.62 CN15.63 CN15.64 CN18.1 CN18.2 CN18.19 CN18.20 CN18.30 CN18.34 CN18.37 H1.1 H2.1 H3.1 H4.1 L3.1 L9.1 X3.2(GND)
Camera_CLK: CN4.20 X3.3(OUT)
I2C1_SCL: CN15.44 CN18.40 R5.1 R295.1 T5.3(D) ; port I2C1_SCL
I2C1_SCL_C: CN4.13 R219.1 R295.2 T5.2(S)
I2C1_SDA: CN15.40 CN18.38 R4.1 R296.1 T6.3(D) ; port I2C1_SDA
I2C1_SDA_C: CN4.14 R224.1 R296.2 T6.2(S)
LCD_B0: CN18.21
LCD_B1: CN18.23
LCD_B2: CN18.25
LCD_B3: CN18.27
LCD_B4: CN18.29
LCD_B5: CN18.31
LCD_B6: CN18.33
LCD_B7: CN18.35
LCD_BL_CTRL: CN15.53 CN18.43 ; port LCD_BL_CTRL
LCD_G0: CN18.4
LCD_G1: CN18.6
LCD_G2: CN18.8
LCD_G3: CN18.10
LCD_G4: CN18.12
LCD_G5: CN18.14
LCD_G6: CN18.16
LCD_G7: CN18.18
LCD_R0: CN18.3
LCD_R1: CN18.5
LCD_R2: CN18.7
LCD_R3: CN15.49 CN18.9 ; port DSI_TE
LCD_R4: CN18.11
LCD_R5: CN18.13
LCD_R6: CN18.15
LCD_R7: CN18.17
PA6: CN4.33 ; port PAR_PCLK
PAR_D0: CN4.23  [project net I2S3_CK]
PAR_D1: CN4.24
PAR_D2: CN4.25
PAR_D3: CN4.26
PAR_D4: CN4.27
PAR_D5: CN4.28
PAR_D6: CN4.29
PAR_D7: CN4.30
PAR_D8: CN4.9 R17.2 ; port EXT_RESET
PAR_D9: CN4.10
PAR_D10: CN4.5
PAR_D11: CN4.6
PB7: CN4.32 ; port PAR_VSYNC
PI12: CN18.26 ; port LCD_HSYNC
PI13: CN18.28 ; port LCD_VSYNC
PI14: CN18.32 ; port LCD_CLK
PK7: CN15.57 R125.1 R153.2 ; port LCD_ENB, port DSI_RESET
RESET#: CN18.36
TOUCH_INT: CN15.4 CN18.39 ; port TOUCH_INT
NetC63_1: C63.1 C66.1 CN18.45 L4.2
NetC63_2: C63.2 C66.2 CN18.47 CN18.49 L3.2
NetC155_1: C155.1 C156.1 CN15.21 CN15.23 L8.2
NetC155_2: C155.2 C156.2 CN15.27 CN15.29 L9.2
NetCN2_1: CN2.1 R4.2
NetCN2_3: CN2.3 R5.2
NetCN2_4: CN2.4 R17.1
NetCN4_15: CN4.15 R218.2 ; port Camera_PLUG
NetCN4_17: CN4.17 R220.1 ; port RSTI
NetCN4_18: CN4.18 TP7.1
NetCN4_19: CN4.19 R225.1 ; port XSDN
NetCN4_31: CN4.31 ; port PAR_HSYNC
NetCN4_34: CN4.34 TP8.1
NetCN4_35: CN4.35 TP11.1
NetCN4_36: CN4.36 TP10.1
NetCN15_3: CN15.3 ; port DSI_CK_P
NetCN15_5: CN15.5 ; port DSI_CK_N
NetCN15_9: CN15.9 ; port DSI_D0_P
NetCN15_11: CN15.11 ; port DSI_D0_N
NetCN15_15: CN15.15 ; port DSI_D1_P
NetCN15_17: CN15.17 ; port DSI_D1_N
NetCN18_22: CN18.22 R153.1
NetR26_1: R26.1 X3.1(EN)

Not connected (* = marked no-connect by the designer): CN2 2 6 8; CN15 2 6 8 10 12 14 16 18 20 22 24 25 26 28 30 31 32 33 34 35 37 38 39 41 42 43 45 46 47 48 50 51 52 54 55 56 58 59 60; CN18 24 41 42 44 46 48

### Buses and harness runs
bus LCD_B[0..7] = port LCD_B[0..7]
bus LCD_G[0..7] = port LCD_G[0..7]
bus LCD_R[0..7] = port LCD_R[0..7]
bus PAR_D[0..11] = port PAR_D[0..11]

### Layout directives
differential pair: NetCN15_3, NetCN15_5, NetCN15_9, NetCN15_11, NetCN15_15, NetCN15_17

### Notes on the sheet
- DSI LCD
- MFX_GPIO14
- To MFX
- Camera
- PC10
- PB8
- PD6
- PB9
- PD2
- PC12
- From MFX
- Open Drains (RSTI & XSDN)
- PC6
- MFX_GPIO12
- MFX_GPIO10
- MFX_GPIO11
- PC7
- (near C52) PB9
- (near C52) PB8
- PC11
- PE5
- PA4
- PA6
- PC8
- PE6
- PC9
- PB7
- PD3
- PA8
- (near R125) PK7
- PJ2
- (near CN4) CLM-120-02-L-D (Samtec)
- RGB LCD
- PG13
- PJ0
- PJ1
- PB1
- PB0
- PI15
- PJ3
- PJ4
- PJ5
- PG6
- PG10
- PJ13
- PH4
- (near R153) PI11
- (near R153) PB5
- PJ12
- PG12
- PJ14
- PJ15
- (near R153) PK7
- (near R153) PI12
- (near R153) PI13
- PK3
- PK4
- PK5
- PK6
- PI14
- EXT/RF E2P Connector
- (near R17) PC10
- (near CN2) SSM-104-L-DH (Samtec)
- FTSH-125-01-F-DV-K (Samtec)
- Title:
- Project:
- Size:
- Date:
- A4
- Reference:
- Sheet:
- Revision:
- of

### Library data of the parts
C52 C63 C105 C106 C122 C123 C156 = Cap: Capacitor; Value: 10nF; Published: 8-Jun-2000; Revision: July-2002: Re-released for DXP Platform.; Publisher: Altium Limited
C66 C155 = Cap Pol1: Polarized Capacitor (Radial); Published: 8-Jun-2000; Revision: July-2002: Re-released for DXP Platform.; Publisher: Altium Limited; Value: 10uF
CN2 = SSM-104-L-DH: Header, 5-Pin, Dual row; Revision: 17-Jul-2002: Re-released for DXP Platform.; Publisher: Altium Limited
CN4 = CLM-120-02-L-D: Header, 20-Pin, Dual row; Revision: 17-Jul-2002: Re-released for DXP Platform.; Publisher: Altium Limited
CN15 = QSH-030-01-F-D-A: HIGH SPEED SOCKET STRIP, .5mm PITCH, 60 PINS; MANUFACTURER: SAMTEC; PCB DECAL: QSH-030-01-X-D-A; CREATED: 28 JAN 2014 - WENDY XIN
CN18 = Header 25X2: Header, 26-Pin, Dual row; Revision: 17-Jul-2002: Re-released for DXP Platform.; Publisher: Altium Limited
L3 L4 L8 L9 = Inductor: Value: 100uH; Published: 8-Jun-2000; Revision: July-2002: Re-released for DXP Platform.; Publisher: Altium Limited
R4 R5 R17 R26 R125 R153 R218 R295 R296 = Res1: Resistor; Value: 1K; Published: 8-Jun-2000; Revision: July-2002: Re-released for DXP Platform.; Publisher: Altium Limited
R219 R220 R224 R225 = res1: Resistor; Value: 1K; Published: 8-Jun-2000; Revision: July-2002: Re-released for DXP Platform.; Publisher: Altium Limited
T5 T6 = 2N7000
TP7 TP8 TP10 TP11 = TP
X3 = SM7745HEV-50.0M

## Sheet Peripherals.SchDoc: Peripherals
size A4; DocumentNumber: MB1165; Revision: C.1; SheetNumber: 12; SheetTotal: 17; Project: STM32469I-EVAL
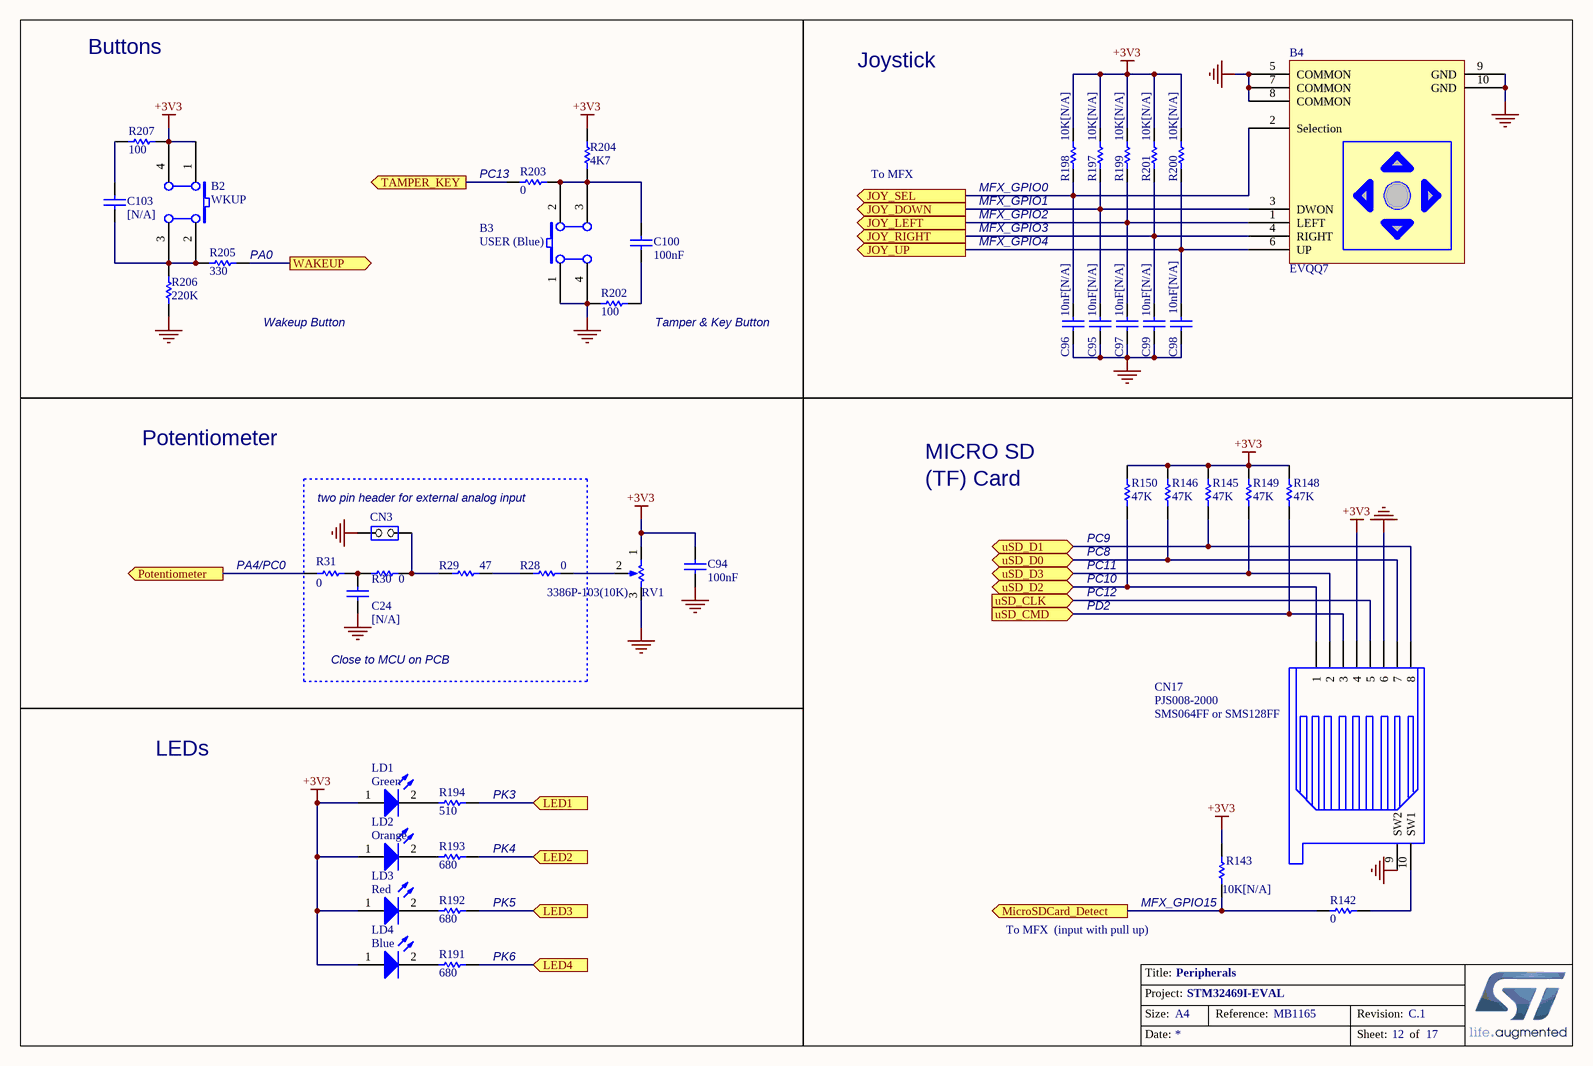
[diagram p16: Peripherals.SchDoc]

### Parts
B2  WKUP  [PB10]
B3  USER (Blue)  [PB10]
B4  EVQQ7  [SW-JOY]
C24  [N/A]  [0603C]
C94  100nF  [0603C]
C95  10nF[N/A]  [0603C]
C96  10nF[N/A]  [0603C]
C97  10nF[N/A]  [0603C]
C98  10nF[N/A]  [0603C]
C99  10nF[N/A]  [0603C]
C100  100nF  [0603C]
C103  [N/A]  [0603C]
CN3  (no value)  [SIP2]
CN17  PJS008-2000  [MSD_PJS008_]
LD1  Green  [0603D]
LD2  Orange  [0603D]
LD3  Red  [0603D]
LD4  Blue  [0603D]
R28  0  [0603R]
R29  47  [0603R]
R30  0  [0603R]
R31  0  [0603R]
R142  0  [0603R]
R143  10K[N/A]  [0603R]
R145  47K  [0603R]
R146  47K  [0603R]
R148  47K  [0603R]
R149  47K  [0603R]
R150  47K  [0603R]
R191  680  [0603R]
R192  680  [0603R]
R193  680  [0603R]
R194  510  [0603R]
R197  10K[N/A]  [0603R]
R198  10K[N/A]  [0603R]
R199  10K[N/A]  [0603R]
R200  10K[N/A]  [0603R]
R201  10K[N/A]  [0603R]
R202  100  [0603R]
R203  0  [0603R]
R204  4K7  [0603R]
R205  330  [0603R]
R206  220K  [0603R]
R207  100  [0603R]
RV1  3386P-103(10K)  [3386P]

### Ports
JOY_DOWN (out), JOY_LEFT (out), JOY_RIGHT (out), JOY_SEL (out), JOY_UP (out), LED1 (in), LED2 (in), LED3 (in), LED4 (in), MicroSDCard_Detect (out), Potentiometer (out), TAMPER_KEY (out), uSD_CLK (in), uSD_CMD (in), uSD_D0 (bidir), uSD_D1 (bidir), uSD_D2 (bidir), uSD_D3 (bidir), WAKEUP (out)

### Nets
+3V3: B2.1(A0) B2.4(A1) C94.1 CN17.4 LD1.1(A) LD2.1(A) LD3.1(A) LD4.1(A) R143.2 R145.1 R146.1 R148.1 R149.1 R150.1 R197.1 R198.1 R199.1 R200.1 R201.1 R204.2 R207.1 RV1.1(BOT)
GND: B3.1(A0) B3.4(A1) B4.5(COMMON) B4.7(COMMON) B4.8(COMMON) B4.9(GND) B4.10(GND) C24.1 C94.2 C95.1 C96.1 C97.1 C98.1 C99.1 CN3.2(NO) CN17.6 CN17.9(SW2) R202.1 R206.2 RV1.3(TOP)
LCD_B4: R194.1 ; port LED1
LCD_B5: R193.1 ; port LED2
LCD_B6: R192.1 ; port LED3
LCD_B7: R191.1 ; port LED4
PAR_D9: CN17.5 ; port uSD_CLK
PC13: R203.2 ; port TAMPER_KEY
NetB2_2: B2.2(B0) B2.3(B1) C103.2 R205.1 R206.1
NetB3_2: B3.2(B0) B3.3(B1) C100.2 R203.1 R204.1
NetB4_1: B4.1(LEFT) C97.2 R199.2 ; port JOY_LEFT
NetB4_2: B4.2(Selection) C96.2 R198.2 ; port JOY_SEL
NetB4_3: B4.3(DWON) C95.2 R197.2 ; port JOY_DOWN
NetB4_4: B4.4(RIGHT) C99.2 R201.2 ; port JOY_RIGHT
NetB4_6: B4.6(UP) C98.2 R200.2 ; port JOY_UP
NetC24_2: C24.2 R30.1 R31.1
NetC100_1: C100.1 R202.2
NetC103_1: C103.1 R207.2
NetCN3_1: CN3.1(COMMON) R29.1 R30.2
NetCN17_1: CN17.1 R150.2 ; port uSD_D2
NetCN17_2: CN17.2 R149.2 ; port uSD_D3
NetCN17_3: CN17.3 R148.2 ; port uSD_CMD
NetCN17_7: CN17.7 R146.2 ; port uSD_D0
NetCN17_8: CN17.8 R145.2 ; port uSD_D1
NetCN17_10: CN17.10(SW1) R142.2
NetJP3_2: R31.2 ; port Potentiometer
NetLD1_2: LD1.2(K) R194.2
NetLD2_2: LD2.2(K) R193.2
NetLD3_2: LD3.2(K) R192.2
NetLD4_2: LD4.2(K) R191.2
NetR28_1: R28.1 R29.2
NetR28_2: R28.2 RV1.2(TAP)
NetR142_1: R142.1 R143.1 ; port MicroSDCard_Detect
NetR163_2: R205.2 ; port WAKEUP

### Notes on the sheet
- Buttons
- Joystick
- (near R203) PC13
- To MFX
- (near R198) MFX_GPIO0
- (near R205) PA0
- MFX_GPIO1
- MFX_GPIO2
- MFX_GPIO3
- MFX_GPIO4
- Wakeup Button
- (near R202) Tamper & Key Button
- Potentiometer
- MICRO SD
- (near CN3) two pin header for external analog input
- (TF) Card
- (near R31) PA4/PC0
- (near R150) PC8
- (near R150) PC9
- PC10
- PC11
- PC12
- Close to MCU on PCB
- PD2
- (near CN17) SMS064FF or SMS128FF
- LEDs
- (near R194) PK3
- (near R193) PK4
- (near R192) PK5
- To MFX  (input with pull up)
- (near R143) MFX_GPIO15
- (near R191) PK6
- Title:
- Project:
- Size:
- Date:
- A4
- Reference:
- Sheet:
- Revision:
- of

### Library data of the parts
B2 B3 = SW PUSHBUTTON: SE PUSHBUTTON
C24 = cap: Capacitor; Value: 100pF; Published: 8-Jun-2000; Revision: July-2002: Re-released for DXP Platform.; Publisher: Altium Limited
C94-C100 C103 = CAP: Capacitor; Value: 100pF; Published: 8-Jun-2000; Revision: July-2002: Re-released for DXP Platform.; Publisher: Altium Limited
CN3 = JP2
CN17 = SMS016AFA5E
LD1-LD4 = LED2: Typical RED, GREEN, YELLOW, AMBER GaAs LED; Published: 8-Jun-2000; Revision: July-2002: Re-released for DXP Platform.; Publisher: Altium Limited
R28-R31 R142 R143 R191-R194 R202 R203 R205 R207 = Res1: Resistor; Value: 1K; Published: 8-Jun-2000; Revision: July-2002: Re-released for DXP Platform.; Publisher: Altium Limited
R145 R146 R148-R150 R197-R201 R204 R206 = res1: Resistor; Value: 1K; Published: 8-Jun-2000; Revision: July-2002: Re-released for DXP Platform.; Publisher: Altium Limited
RV1 = RV